# Altium schematic sheet Mako DSP QuadFlash and Boot.SchDoc
size A
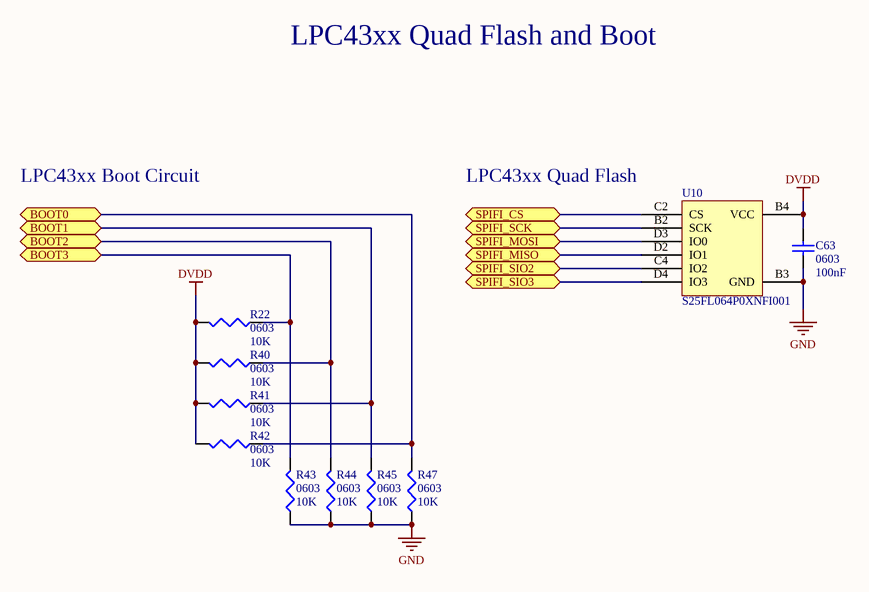
[diagram p0: Mako DSP QuadFlash and Boot.SchDoc]

## Parts
C63  0603  value 100nF  [1608[0603]]
R22  0603  value 10K  [J1-0603]
R40  0603  value 10K  [J1-0603]
R41  0603  value 10K  [J1-0603]
R42  0603  value 10K  [J1-0603]
R43  0603  value 10K  [J1-0603]
R44  0603  value 10K  [J1-0603]
R45  0603  value 10K  [J1-0603]
R47  0603  value 10K  [J1-0603]
U10  S25FL064P0XNFI001  [S25FL064P0XNFI001]

## Ports
BOOT0, BOOT1, BOOT2, BOOT3, SPIFI_CS, SPIFI_MISO, SPIFI_MOSI, SPIFI_SCK, SPIFI_SIO2, SPIFI_SIO3

## Nets
DVDD: C63.2 R22.2 R40.2 R41.2 R42.2 U10.B4(VCC)
GND: C63.1 R43.1 R44.1 R45.1 R47.1 U10.B3(GND)
BOOT0: R42.1 R47.2 ; port BOOT0
BOOT1: R41.1 R45.2 ; port BOOT1
BOOT2: R40.1 R44.2 ; port BOOT2
BOOT3: R22.1 R43.2 ; port BOOT3
SPIFI_CS: U10.C2(CS) ; port SPIFI_CS
SPIFI_MISO: U10.D2(IO1) ; port SPIFI_MISO
SPIFI_MOSI: U10.D3(IO0) ; port SPIFI_MOSI
SPIFI_SCK: U10.B2(SCK) ; port SPIFI_SCK
SPIFI_SIO2: U10.C4(IO2) ; port SPIFI_SIO2
SPIFI_SIO3: U10.D4(IO3) ; port SPIFI_SIO3

Not connected (* = marked no-connect by the designer): U10 A2(NC) A3(NC) A4(NC) A5(NC) B1(NC) B5(NC) C1(NC) C5(NC) D1(NC) D5(NC) E1(NC) E2(NC) E3(NC) E4(NC) E5(NC)

## Notes on the sheet
- LPC43xx Quad Flash and Boot
- LPC43xx Boot Circuit
- (near U10) LPC43xx Quad Flash

## Library data of the parts
C63 = Cap Semi: Capacitor (Semiconductor SIM Model); Published: 8-Jun-2000; LatestRevisionDate: 29-May-2009; LatestRevisionNote: IPC-7351 Footprint Added.; PackageReference: C1206; Publisher: Altium Limited; PackageDescription: Chip Capacitor
R22 R40-R45 R47 = Res3: Resistor; Published: 8-Jun-2000; LatestRevisionDate: 29-May-2009; LatestRevisionNote: IPC-7351 Footprint Added.; PackageReference: J1-0603; Publisher: Altium Limited; PackageDescription: Chip Resistor
U10 = S25FL064P0XNFI001: SPIFI Quad Flash